# Altium schematic sheet Charging System.SchDoc
size A4; SheetNumber: 6; SheetTotal: 8
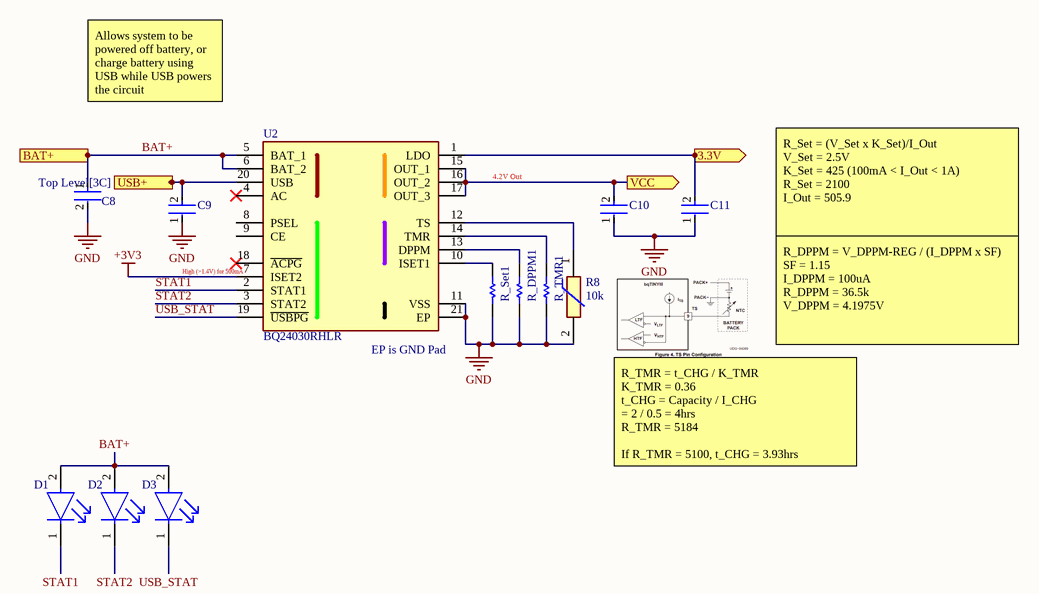
[diagram p0: Charging System.SchDoc]

## Parts
C8  06033D105KAT2A  [FP-0603-L_1_6_0_15-W_0_81-IPC_C]  (value not drawn)
C9  C1608X5R1A106K080AC  [FP-C1608-080-0_1-MFG]  (value not drawn)
C10  C1608X5R1A106K080AC  [FP-C1608-080-0_1-MFG]  (value not drawn)
C11  C1608X5R1A106K080AC  [FP-C1608-080-0_1-MFG]  (value not drawn)
D1  LTST-C190GKT  [FP-LTST-C190GKT-MFG]  (value not drawn)
D2  LTST-C190GKT  [FP-LTST-C190GKT-MFG]  (value not drawn)
D3  LTST-C190GKT  [FP-LTST-C190GKT-MFG]  (value not drawn)
R8  value 10k  [NTCALUG03A103GA]  (hidden comment: NTCALUG39A103GA)
R_DPPM1  RQ73C1J36K5BTD  [0603]  (value not drawn)
R_Set1  CRCW06032K10FKEAC  [0603]  (value not drawn)
R_TMR1  ERA-3AED512V  [0603]  (value not drawn)
U2  BQ24030RHLR  [BQ51050BRHLR]

## Ports
3.3V (out, see Top Level[4C]), BAT+ (in, see Top Level[3B], Battery Protection[3B]), USB+ (in, see Top Level[3C]), VCC (out, see Top Level[4B], Voltage Regulation[1B])

## Nets
+3V3: U2.7(ISET2)
GND: C8.2 C9.1 C10.1 C11.1 R8.2 R_DPPM1.1 R_Set1.2 R_TMR1.1 U2.11(VSS) U2.21(EP)
3.3V: C11.2 U2.1(LDO) ; port 3.3V
BAT+: C8.1 D1.2(A) D2.2(A) D3.2(A) U2.5(BAT_1) U2.6(BAT_2) ; port BAT+
STAT1: D1.1(C) U2.2(STAT1)
STAT2: D2.1(C) U2.3(STAT2)
USB+: C9.2 U2.20(USB) ; port USB+
USB_STAT: D3.1(C) U2.19(~{USBPG})
VCC: C10.2 U2.15(OUT_1) U2.16(OUT_2) U2.17(OUT_3) ; port VCC
NetR8_1: R8.1 U2.12(TS)
NetR_DPPM1_2: R_DPPM1.2 U2.13(DPPM)
NetR_Set1_1: R_Set1.1 U2.10(ISET1)
NetR_TMR1_2: R_TMR1.2 U2.14(TMR)

Not connected (* = marked no-connect by the designer): U2 4(AC)* 8(PSEL) 9(CE) 18(~{ACPG})*

## Notes on the sheet
- Allows system to be powered off battery, or charge battery using USB while USB powers the circuit
- 4.2V Out
- (near U2) High (>1.4V) for 500mA
- R_Set = (V_Set x K_Set)/I_Out
  V_Set = 2.5V
  K_Set = 425 (100mA < I_Out < 1A)
  R_Set = 2100
  I_Out = 505.9
- (near U2) EP is GND Pad
- R_DPPM = V_DPPM-REG / (I_DPPM x SF)
  SF = 1.15
  I_DPPM = 100uA
  R_DPPM = 36.5k
  V_DPPM = 4.1975V
- R_TMR = t_CHG / K_TMR
  K_TMR = 0.36
  t_CHG = Capacity / I_CHG
  = 2 / 0.5 = 4hrs
  R_TMR = 5184
  If R_TMR = 5100, t_CHG = 3.93hrs

## Library data of the parts
C8 = CMP-2006-04193-2: General Purpose Ceramic Capacitor, 0603, 1uF, 10%, X5R, 15%, 25V; Insulation Resistance: 10GR; Dissipation Factor: 12.5%; Lead Free: Lead Free; Max Operating Temperature: 85°C; Construction: Flat; Series: -; Number of Pins: 2; Dielectric: X5R; RoHS Compliant: Yes; Radiation Hardening: No; Package Quantity: 1; Height: 0.9mm; Capacitance: 1uF; Tolerance: 10%; Termination: SMD/SMT; Voltage Rating: 25V; Case Code (Imperial): 0603; Min Operating Temperature: -55°C; Packaging: Tape and Reel; Width: 0.032inch; Thickness: 0.035inch; REACH SVHC: No SVHC; Voltage Rating (DC): 25V; Case/Package: 0603; Voltage: 25V; Depth: 0.81mm; Mount: Surface Mount; Dielectric Material: Ceramic; Contact Plating: Tin; Length: 1.6mm; Case Code (Metric): 1608
C9-C11 = CMP-2000-04979-3: Multilayer Ceramic Capacitors 10μF ±10% 10V X5R SMD 0603; Capacitance: 10uF; Dielectric Material: Ceramic; Construction: Flat; Height: 0.8mm; Thickness: 0.035inch; Case Code (Metric): 1608; Radiation Hardening: No; Number of Pins: 2; Voltage Rating (DC): 10V; Depth: 0.8mm; Voltage: 10V; RoHS Compliant: Yes; Voltage Rating: 10V; Package Quantity: 1; Resistor Type: Ceramic; Termination: SMD/SMT; Lead Free: Lead Free; REACH SVHC: No SVHC; Tolerance: 10%; Mount: Surface Mount; Series: C; Packaging: Tape and Reel; Width: 0.8mm; Dielectric: X5R; Weight: 7.1E-05oz; Length: 1.6mm; Max Operating Temperature: 85°C; Case Code (Imperial): 0603; Case/Package: 0603; Min Operating Temperature: -55°C
D1-D3 = CMP-22017-000005-2: LED GREEN CLEAR CHIP SMD; Dominant Wavelength: 569nm; Reverse Voltage: 5V; Lens Color: Colorless; Viewing Angle: 130°; Voltage: 2V; Forward Current: 30mA; Power Dissipation: 100mW; Luminous Intensity: 6mcd; Number of LEDs: 1; Forward Voltage: 2.1V; Wavelength: 565nm; Test Current: 10mA; Min Operating Temperature: -55°C; Lens Style: Clear; Mount: Surface Mount; Width: 0.8mm; Packaging: Tape and Reel; Lens Transparency: Clear; Case Code (Metric): 1608; Depth: 0.8mm; Case Code (Imperial): 0603; Case/Package: 0603; Number of Pins: 2; Max Operating Temperature: 85°C; Lead Free: Lead Free; Number of Elements: 1; Length: 1.6mm; Height: 0.8mm; Package Quantity: 1; Power Rating: 100mW; Radiation Hardening: No; Illumination Color: Green; Color: Green
R8 = NTCALUG39A103GA: NTC (Negative Temperature Coefficient) Thermistors 10K/2% 3984K/0.5% AEC-Q200 70mm; Beta Parameter: 3984 K; Tolerance: 2%; Voltage Rating: 1kV; RoHS Compliant: RoHS; Case/Package: Wire Lead; Max Operating Temperature: 125°C; Mounting Technology: Ring Lug; Min Operating Temperature: -40°C; Pins: 2
R_DPPM1 = RQ73C1J36K5BTD: Thin Film Resistors - SMD RN 0603 36K5 0.1% 10PPM; Value: 36.5k
R_Set1 = CRCW06032K10FKEAC: Thick Film Resistors - SMD 1/10Watt 2.1Kohms 1%; Value: 2.1K
R_TMR1 = ERA-3AED512V: Thin Film Resistors - SMD 0603 5100ohms 25ppm 0.5% AEC-Q200; Value: 5.1k
U2 = BQ24030RHLR: Battery Management Charger w/Dynamic Power-Path Mngmnt; Manufacturer_Name: Texas Instruments; Datasheet Link: http://www.ti.com/lit/gpn/bq24030; Manufacturer_Part_Number: BQ24030RHLR; Mouser Part Number: 595-BQ24030RHLR; Mouser Price/Stock: https://www.mouser.co.uk/ProductDetail/Texas-Instruments/BQ24030RHLR/?qs=%252BvKcWiXw%252BzShgRCa3gfG7Q%3D%3D; Arrow Part Number: BQ24030RHLR; Arrow Price/Stock: https://www.arrow.com/en/products/bq24030rhlr/texas-instruments